# Altium schematic sheet BTT-SFS-HAT.SchDoc
size A3; SheetNumber: 1; SheetTotal: 1
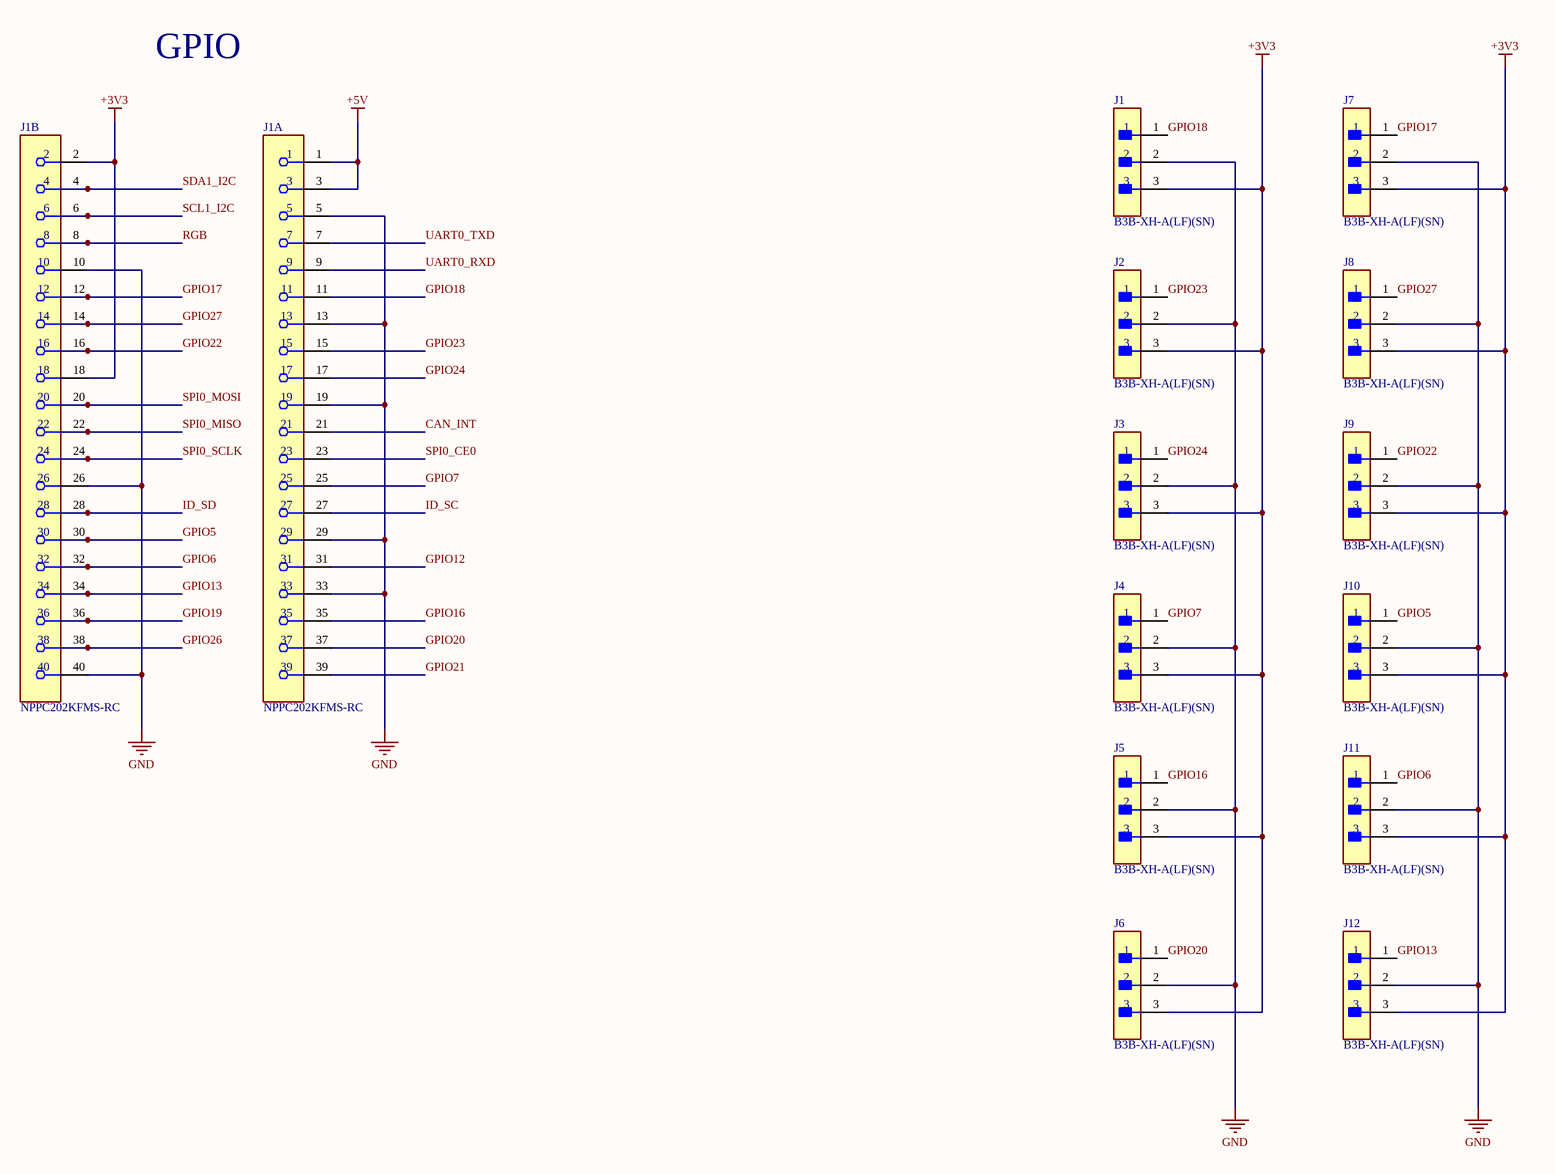
[diagram p0: BTT-SFS-HAT.SchDoc]

## Parts
(Parts that share a designator on the sheet are numbered #1, #2 ... from top to bottom, then left to right.)
J1#1  B3B-XH-A(LF)(SN)  [FP-B3B-XH-A_LF_SN-MFG]
J1#2  NPPC202KFMS-RC  [FP-NPPC202KFMS-RC-MFG]  (parts A,B of 2)
J2  B3B-XH-A(LF)(SN)  [FP-B3B-XH-A_LF_SN-MFG]
J3  B3B-XH-A(LF)(SN)  [FP-B3B-XH-A_LF_SN-MFG]
J4  B3B-XH-A(LF)(SN)  [FP-B3B-XH-A_LF_SN-MFG]
J5  B3B-XH-A(LF)(SN)  [FP-B3B-XH-A_LF_SN-MFG]
J6  B3B-XH-A(LF)(SN)  [FP-B3B-XH-A_LF_SN-MFG]
J7  B3B-XH-A(LF)(SN)  [FP-B3B-XH-A_LF_SN-MFG]
J8  B3B-XH-A(LF)(SN)  [FP-B3B-XH-A_LF_SN-MFG]
J9  B3B-XH-A(LF)(SN)  [FP-B3B-XH-A_LF_SN-MFG]
J10  B3B-XH-A(LF)(SN)  [FP-B3B-XH-A_LF_SN-MFG]
J11  B3B-XH-A(LF)(SN)  [FP-B3B-XH-A_LF_SN-MFG]
J12  B3B-XH-A(LF)(SN)  [FP-B3B-XH-A_LF_SN-MFG]

## Nets
+3V3: J1#1.3 J1#2.2 J1#2.18 J2.3 J3.3 J4.3 J5.3 J6.3 J7.3 J8.3 J9.3 J10.3 J11.3 J12.3
+5V: J1#2.1 J1#2.3
GND: J1#1.2 J1#2.5 J1#2.10 J1#2.13 J1#2.19 J1#2.26 J1#2.29 J1#2.33 J1#2.40 J2.2 J3.2 J4.2 J5.2 J6.2 J7.2 J8.2 J9.2 J10.2 J11.2 J12.2
CAN_INT: J1#2.21
GPIO5: J1#2.30 J10.1
GPIO6: J1#2.32 J11.1
GPIO7: J1#2.25 J4.1
GPIO12: J1#2.31
GPIO13: J1#2.34 J12.1
GPIO16: J1#2.35 J5.1
GPIO17: J1#2.12 J7.1
GPIO18: J1#1.1 J1#2.11
GPIO19: J1#2.36
GPIO20: J1#2.37 J6.1
GPIO21: J1#2.39
GPIO22: J1#2.16 J9.1
GPIO23: J1#2.15 J2.1
GPIO24: J1#2.17 J3.1
GPIO26: J1#2.38
GPIO27: J1#2.14 J8.1
ID_SC: J1#2.27
ID_SD: J1#2.28
RGB: J1#2.8
SCL1_I2C: J1#2.6
SDA1_I2C: J1#2.4
SPI0_CE0: J1#2.23
SPI0_MISO: J1#2.22
SPI0_MOSI: J1#2.20
SPI0_SCLK: J1#2.24
UART0_RXD: J1#2.9
UART0_TXD: J1#2.7

## Notes on the sheet
- GPIO

## Library data of the parts
J1#1 J2-J12 = CMP-002-00077-1: Connector Header, XH Series, 3 Position, 2.50mm, Through Hole, Press-Fit, Solder, Natural
J1#2 = CMP-25680-000027-1: CONN HDR 40POS 0.1 GOLD SMD; Row Spacing: 0.1inch; Connector Type: Header; Number of Positions: 40; Mount: Surface Mount; Contact Material: Bronze; Color: Black; Package Quantity: 1000; Width: 5mm; Housing Material: Nylon; Height: 7.1mm; Termination: Solder; Pitch: 0.1inch; Length: 51.3mm; Packaging: Bulk; Contact Plating: Gold; Housing Color: Black; Number of Rows: 2; Lead Free: Lead Free